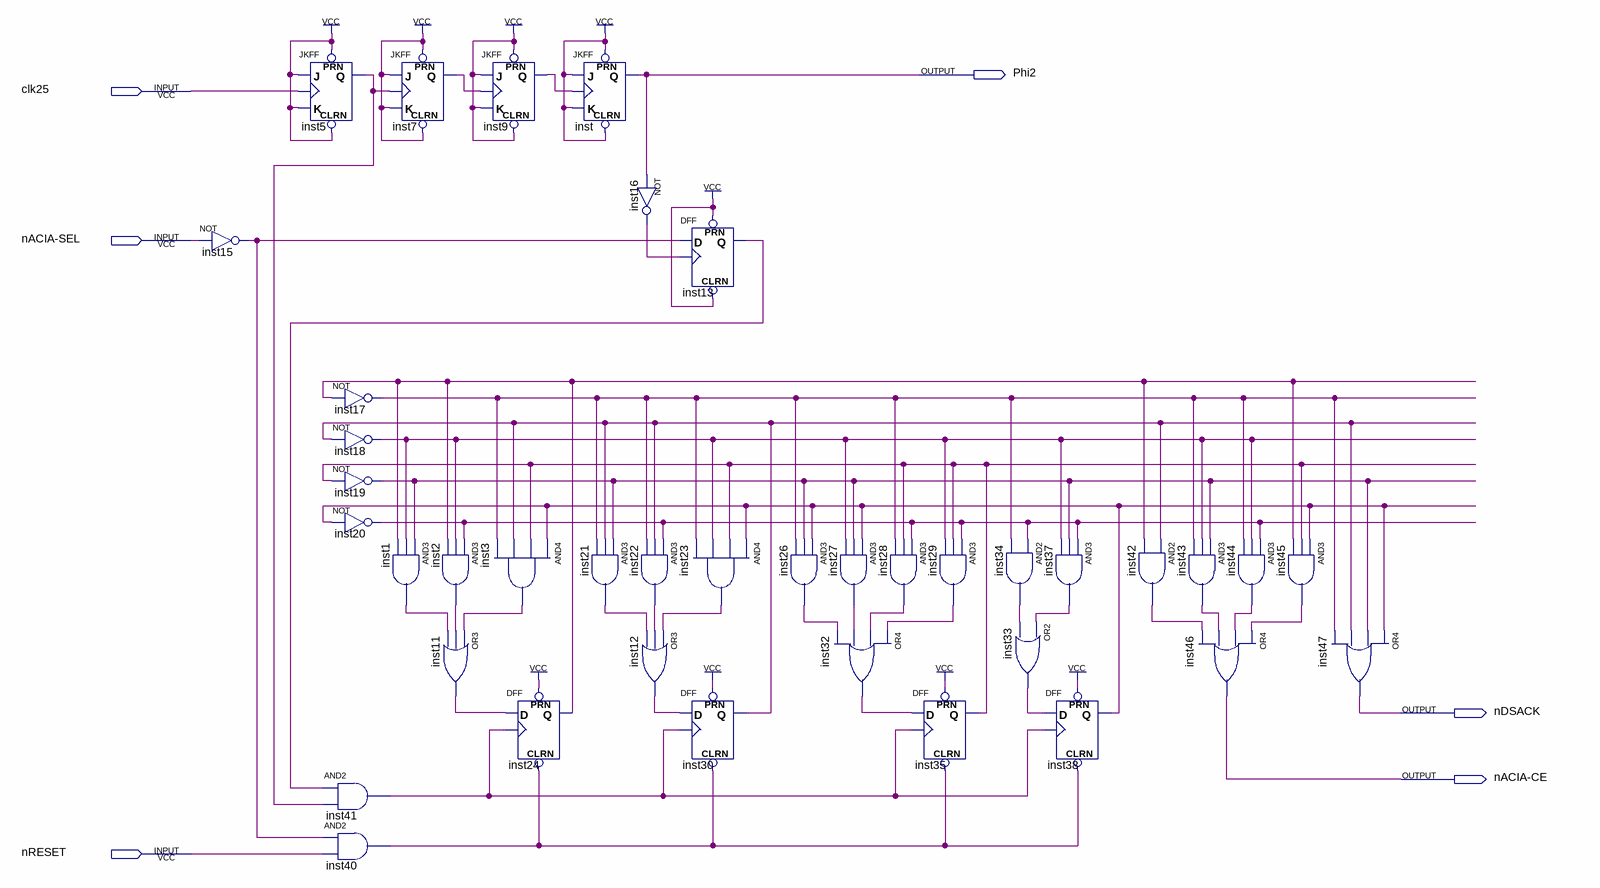
[diagram p0: schematic sheet]
// Quartus schematic ACIA30.bdf as structural Verilog: 39 symbols, 6 pins
module ACIA30 (
  input  clk25,
  input  \nACIA-SEL ,
  input  nRESET,
  output Phi2,
  output nDSACK,
  output \nACIA-CE 
);

  wire inst1_out, inst2_out, inst3_out, inst5_q, inst7_q, inst9_q, inst11_out, inst12_out, inst13_q,
       inst15_out, inst16_out, inst17_out, inst18_out, inst19_out, inst20_out, inst21_out, inst22_out,
       inst23_out, inst24_q, inst26_out, inst27_out, inst28_out, inst29_out, inst30_q, inst32_out,
       inst33_out, inst34_out, inst35_q, inst37_out, inst38_q, inst40_out, inst41_out, inst42_out,
       inst43_out, inst44_out, inst45_out;

  not inst15 (inst15_out, \nACIA-SEL );
  JKFF inst5 (.PRN(1'b1), .CLRN(1'b1), .K(1'b1), .J(1'b1), .CLK(clk25), .Q(inst5_q));
  not inst17 (inst17_out, inst24_q);
  not inst18 (inst18_out, inst30_q);
  not inst19 (inst19_out, inst35_q);
  not inst20 (inst20_out, inst38_q);
  and inst1 (inst1_out, inst19_out, inst18_out, inst24_q);
  and inst41 (inst41_out, inst13_q, inst5_q);
  and inst40 (inst40_out, inst15_out, nRESET);
  JKFF inst7 (.PRN(1'b1), .CLRN(1'b1), .K(1'b1), .J(1'b1), .CLK(inst5_q), .Q(inst7_q));
  and inst2 (inst2_out, inst20_out, inst18_out, inst24_q);
  or inst11 (inst11_out, inst3_out, inst2_out, inst1_out);
  JKFF inst9 (.PRN(1'b1), .CLRN(1'b1), .K(1'b1), .J(1'b1), .CLK(inst7_q), .Q(inst9_q));
  and inst3 (inst3_out, inst38_q, inst35_q, inst30_q, inst17_out);
  DFF inst24 (.CLRN(inst40_out), .CLK(inst41_out), .D(inst11_out), .PRN(1'b1), .Q(inst24_q));
  JKFF inst (.PRN(1'b1), .CLRN(1'b1), .K(1'b1), .J(1'b1), .CLK(inst9_q), .Q(Phi2));
  and inst21 (inst21_out, inst19_out, inst30_q, inst17_out);
  not inst16 (inst16_out, Phi2);
  and inst22 (inst22_out, inst20_out, inst30_q, inst17_out);
  or inst12 (inst12_out, inst23_out, inst22_out, inst21_out);
  DFF inst13 (.CLRN(1'b1), .CLK(inst16_out), .D(inst15_out), .PRN(1'b1), .Q(inst13_q));
  and inst23 (inst23_out, inst38_q, inst35_q, inst18_out, inst17_out);
  DFF inst30 (.CLRN(inst40_out), .CLK(inst41_out), .D(inst12_out), .PRN(1'b1), .Q(inst30_q));
  and inst26 (inst26_out, inst38_q, inst19_out, inst17_out);
  and inst27 (inst27_out, inst38_q, inst19_out, inst18_out);
  or inst32 (inst32_out, inst29_out, inst28_out, inst27_out, inst26_out);
  and inst28 (inst28_out, inst20_out, inst35_q, inst17_out);
  DFF inst35 (.CLRN(inst40_out), .CLK(inst41_out), .D(inst32_out), .PRN(1'b1), .Q(inst35_q));
  and inst29 (inst29_out, inst20_out, inst35_q, inst18_out);
  and inst34 (inst34_out, inst20_out, inst17_out);
  and inst37 (inst37_out, inst20_out, inst19_out, inst18_out);
  or inst33 (inst33_out, inst37_out, inst34_out);
  DFF inst38 (.CLRN(inst40_out), .CLK(inst41_out), .D(inst33_out), .PRN(1'b1), .Q(inst38_q));
  and inst42 (inst42_out, inst30_q, inst24_q);
  and inst43 (inst43_out, inst19_out, inst18_out, inst17_out);
  and inst44 (inst44_out, inst20_out, inst18_out, inst17_out);
  or inst46 (\nACIA-CE , inst45_out, inst44_out, inst43_out, inst42_out);
  and inst45 (inst45_out, inst38_q, inst35_q, inst24_q);
  or inst47 (nDSACK, inst38_q, inst19_out, inst30_q, inst17_out);
endmodule
